# EAGLE design 4U-4452 (EAGLE 6.6.0)
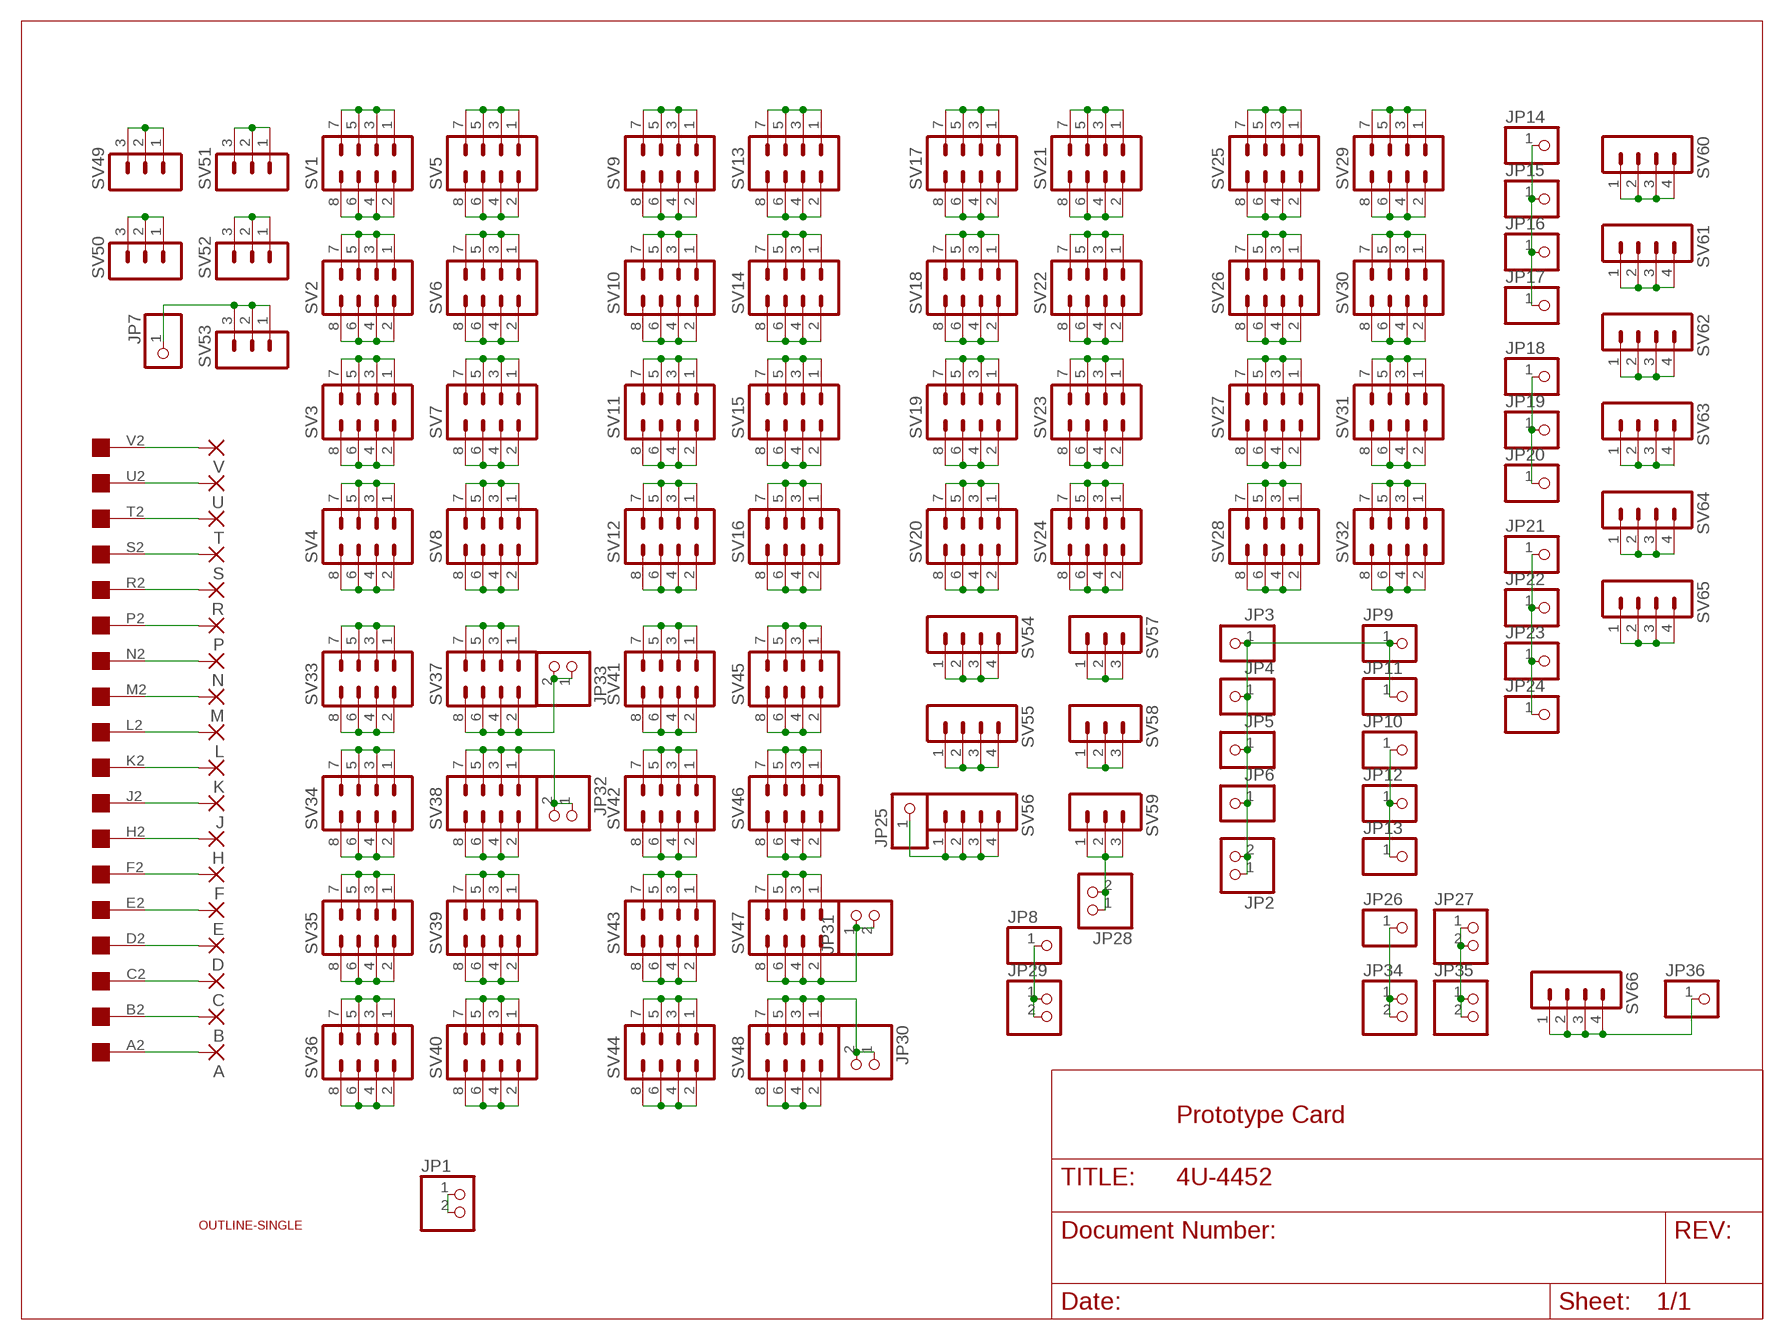
[diagram p0: schematic, sheet 1]

## Parts
A  3,17/1,1  [3,17/1,1]
B  3,17/1,1  [3,17/1,1]
C  3,17/1,1  [3,17/1,1]
D  3,17/1,1  [3,17/1,1]
E  3,17/1,1  [3,17/1,1]
F  3,17/1,1  [3,17/1,1]
H  3,17/1,1  [3,17/1,1]
J  3,17/1,1  [3,17/1,1]
JP1  PINHD-1X2  [1X02]
JP2  PINHD-1X2  [1X02]
JP3  PINHD-1X1  [1X01]
JP4  PINHD-1X1  [1X01]
JP5  PINHD-1X1  [1X01]
JP6  PINHD-1X1  [1X01]
JP7  PINHD-1X1  [1X01]
JP8  PINHD-1X1  [1X01]
JP9  PINHD-1X1  [1X01]
JP10  PINHD-1X1  [1X01]
JP11  PINHD-1X1  [1X01]
JP12  PINHD-1X1  [1X01]
JP13  PINHD-1X1  [1X01]
JP14  PINHD-1X1  [1X01]
JP15  PINHD-1X1  [1X01]
JP16  PINHD-1X1  [1X01]
JP17  PINHD-1X1  [1X01]
JP18  PINHD-1X1  [1X01]
JP19  PINHD-1X1  [1X01]
JP20  PINHD-1X1  [1X01]
JP21  PINHD-1X1  [1X01]
JP22  PINHD-1X1  [1X01]
JP23  PINHD-1X1  [1X01]
JP24  PINHD-1X1  [1X01]
JP25  PINHD-1X1  [1X01]
JP26  PINHD-1X1  [1X01]
JP27  PINHD-1X2  [1X02]
JP28  PINHD-1X2  [1X02]
JP29  PINHD-1X2  [1X02]
JP30  PINHD-1X2  [1X02]
JP31  PINHD-1X2  [1X02]
JP32  PINHD-1X2  [1X02]
JP33  PINHD-1X2  [1X02]
JP34  PINHD-1X2  [1X02]
JP35  PINHD-1X2  [1X02]
JP36  PINHD-1X1  [1X01]
K  3,17/1,1  [3,17/1,1]
L  3,17/1,1  [3,17/1,1]
M  3,17/1,1  [3,17/1,1]
N  3,17/1,1  [3,17/1,1]
P  3,17/1,1  [3,17/1,1]
R  3,17/1,1  [3,17/1,1]
S  3,17/1,1  [3,17/1,1]
SV1  MA04-2  [MA04-2]
SV2  MA04-2  [MA04-2]
SV3  MA04-2  [MA04-2]
SV4  MA04-2  [MA04-2]
SV5  MA04-2  [MA04-2]
SV6  MA04-2  [MA04-2]
SV7  MA04-2  [MA04-2]
SV8  MA04-2  [MA04-2]
SV9  MA04-2  [MA04-2]
SV10  MA04-2  [MA04-2]
SV11  MA04-2  [MA04-2]
SV12  MA04-2  [MA04-2]
SV13  MA04-2  [MA04-2]
SV14  MA04-2  [MA04-2]
SV15  MA04-2  [MA04-2]
SV16  MA04-2  [MA04-2]
SV17  MA04-2  [MA04-2]
SV18  MA04-2  [MA04-2]
SV19  MA04-2  [MA04-2]
SV20  MA04-2  [MA04-2]
SV21  MA04-2  [MA04-2]
SV22  MA04-2  [MA04-2]
SV23  MA04-2  [MA04-2]
SV24  MA04-2  [MA04-2]
SV25  MA04-2  [MA04-2]
SV26  MA04-2  [MA04-2]
SV27  MA04-2  [MA04-2]
SV28  MA04-2  [MA04-2]
SV29  MA04-2  [MA04-2]
SV30  MA04-2  [MA04-2]
SV31  MA04-2  [MA04-2]
SV32  MA04-2  [MA04-2]
SV33  MA04-2  [MA04-2]
SV34  MA04-2  [MA04-2]
SV35  MA04-2  [MA04-2]
SV36  MA04-2  [MA04-2]
SV37  MA04-2  [MA04-2]
SV38  MA04-2  [MA04-2]
SV39  MA04-2  [MA04-2]
SV40  MA04-2  [MA04-2]
SV41  MA04-2  [MA04-2]
SV42  MA04-2  [MA04-2]
SV43  MA04-2  [MA04-2]
SV44  MA04-2  [MA04-2]
SV45  MA04-2  [MA04-2]
SV46  MA04-2  [MA04-2]
SV47  MA04-2  [MA04-2]
SV48  MA04-2  [MA04-2]
SV49  MA03-1  [MA03-1]
SV50  MA03-1  [MA03-1]
SV51  MA03-1  [MA03-1]
SV52  MA03-1  [MA03-1]
SV53  MA03-1  [MA03-1]
SV54  MA04-1  [MA04-1]
SV55  MA04-1  [MA04-1]
SV56  MA04-1  [MA04-1]
SV57  MA03-1  [MA03-1]
SV58  MA03-1  [MA03-1]
SV59  MA03-1  [MA03-1]
SV60  MA04-1  [MA04-1]
SV61  MA04-1  [MA04-1]
SV62  MA04-1  [MA04-1]
SV63  MA04-1  [MA04-1]
SV64  MA04-1  [MA04-1]
SV65  MA04-1  [MA04-1]
SV66  MA04-1  [MA04-1]
T  3,17/1,1  [3,17/1,1]
U  3,17/1,1  [3,17/1,1]
U$1  EDGE-1  [EDGE-CON1]
U$2  OUTLINE-SINGLE  [SINGLE]
V  3,17/1,1  [3,17/1,1]

## Nets
A: A.1(P) U$1.A2
B: B.1(P) U$1.B2
D: D.1(P) U$1.D2
GND: C.1(P) U$1.C2
N$1: U$1.V2 V.1(P)
N$2: U$1.U2 U.1(P)
N$3: T.1(P) U$1.T2
N$4: S.1(P) U$1.S2
N$5: R.1(P) U$1.R2
N$6: P.1(P) U$1.P2
N$7: N.1(P) U$1.N2
N$8: M.1(P) U$1.M2
N$9: L.1(P) U$1.L2
N$10: K.1(P) U$1.K2
N$11: J.1(P) U$1.J2
N$12: H.1(P) U$1.H2
N$13: F.1(P) U$1.F2
N$14: E.1(P) U$1.E2
N$15: SV1.1 SV1.3 SV1.5 SV1.7
N$16: SV1.2 SV1.4 SV1.6 SV1.8
N$17: SV2.1 SV2.3 SV2.5 SV2.7
N$18: SV2.2 SV2.4 SV2.6 SV2.8
N$19: SV3.1 SV3.3 SV3.5 SV3.7
N$20: SV3.2 SV3.4 SV3.6 SV3.8
N$21: SV4.1 SV4.3 SV4.5 SV4.7
N$22: SV4.2 SV4.4 SV4.6 SV4.8
N$23: SV5.1 SV5.3 SV5.5 SV5.7
N$24: SV5.2 SV5.4 SV5.6 SV5.8
N$25: SV6.1 SV6.3 SV6.5 SV6.7
N$26: SV6.2 SV6.4 SV6.6 SV6.8
N$27: SV7.1 SV7.3 SV7.5 SV7.7
N$28: SV7.2 SV7.4 SV7.6 SV7.8
N$29: SV8.1 SV8.3 SV8.5 SV8.7
N$30: SV8.2 SV8.4 SV8.6 SV8.8
N$31: SV9.1 SV9.3 SV9.5 SV9.7
N$32: SV9.2 SV9.4 SV9.6 SV9.8
N$33: SV10.1 SV10.3 SV10.5 SV10.7
N$34: SV10.2 SV10.4 SV10.6 SV10.8
N$35: SV11.1 SV11.3 SV11.5 SV11.7
N$36: SV11.2 SV11.4 SV11.6 SV11.8
N$37: SV12.1 SV12.3 SV12.5 SV12.7
N$38: SV12.2 SV12.4 SV12.6 SV12.8
N$39: SV13.1 SV13.3 SV13.5 SV13.7
N$40: SV13.2 SV13.4 SV13.6 SV13.8
N$41: SV14.1 SV14.3 SV14.5 SV14.7
N$42: SV14.2 SV14.4 SV14.6 SV14.8
N$43: SV15.1 SV15.3 SV15.5 SV15.7
N$44: SV15.2 SV15.4 SV15.6 SV15.8
N$45: SV16.1 SV16.3 SV16.5 SV16.7
N$46: SV16.2 SV16.4 SV16.6 SV16.8
N$47: SV17.1 SV17.3 SV17.5 SV17.7
N$48: SV17.2 SV17.4 SV17.6 SV17.8
N$49: SV18.1 SV18.3 SV18.5 SV18.7
N$50: SV18.2 SV18.4 SV18.6 SV18.8
N$51: SV19.1 SV19.3 SV19.5 SV19.7
N$52: SV19.2 SV19.4 SV19.6 SV19.8
N$53: SV20.1 SV20.3 SV20.5 SV20.7
N$54: SV20.2 SV20.4 SV20.6 SV20.8
N$55: SV21.1 SV21.3 SV21.5 SV21.7
N$56: SV21.2 SV21.4 SV21.6 SV21.8
N$57: SV22.1 SV22.3 SV22.5 SV22.7
N$58: SV22.2 SV22.4 SV22.6 SV22.8
N$59: SV23.1 SV23.3 SV23.5 SV23.7
N$60: SV23.2 SV23.4 SV23.6 SV23.8
N$61: SV24.1 SV24.3 SV24.5 SV24.7
N$62: SV24.2 SV24.4 SV24.6 SV24.8
N$63: SV25.1 SV25.3 SV25.5 SV25.7
N$64: SV25.2 SV25.4 SV25.6 SV25.8
N$65: SV26.1 SV26.3 SV26.5 SV26.7
N$66: SV26.2 SV26.4 SV26.6 SV26.8
N$67: SV27.1 SV27.3 SV27.5 SV27.7
N$68: SV27.2 SV27.4 SV27.6 SV27.8
N$69: SV28.1 SV28.3 SV28.5 SV28.7
N$70: SV28.2 SV28.4 SV28.6 SV28.8
N$71: SV29.1 SV29.3 SV29.5 SV29.7
N$72: SV29.2 SV29.4 SV29.6 SV29.8
N$73: SV30.1 SV30.3 SV30.5 SV30.7
N$74: SV30.2 SV30.4 SV30.6 SV30.8
N$75: SV31.1 SV31.3 SV31.5 SV31.7
N$76: SV31.2 SV31.4 SV31.6 SV31.8
N$77: SV32.1 SV32.3 SV32.5 SV32.7
N$78: SV32.2 SV32.4 SV32.6 SV32.8
N$79: SV33.1 SV33.3 SV33.5 SV33.7
N$80: SV33.2 SV33.4 SV33.6 SV33.8
N$81: SV34.1 SV34.3 SV34.5 SV34.7
N$82: SV34.2 SV34.4 SV34.6 SV34.8
N$83: SV35.1 SV35.3 SV35.5 SV35.7
N$84: SV35.2 SV35.4 SV35.6 SV35.8
N$85: SV36.1 SV36.3 SV36.5 SV36.7
N$86: SV36.2 SV36.4 SV36.6 SV36.8
N$87: SV37.1 SV37.3 SV37.5 SV37.7
N$88: JP33.1 JP33.2 SV37.2 SV37.4 SV37.6 SV37.8
N$89: JP32.1 JP32.2 SV38.1 SV38.3 SV38.5 SV38.7
N$90: SV38.2 SV38.4 SV38.6 SV38.8
N$91: SV39.1 SV39.3 SV39.5 SV39.7
N$92: SV39.2 SV39.4 SV39.6 SV39.8
N$93: SV40.1 SV40.3 SV40.5 SV40.7
N$94: SV40.2 SV40.4 SV40.6 SV40.8
N$95: SV41.1 SV41.3 SV41.5 SV41.7
N$96: SV41.2 SV41.4 SV41.6 SV41.8
N$97: SV42.1 SV42.3 SV42.5 SV42.7
N$98: SV42.2 SV42.4 SV42.6 SV42.8
N$99: SV43.1 SV43.3 SV43.5 SV43.7
N$100: SV43.2 SV43.4 SV43.6 SV43.8
N$101: SV44.1 SV44.3 SV44.5 SV44.7
N$102: SV44.2 SV44.4 SV44.6 SV44.8
N$103: SV45.1 SV45.3 SV45.5 SV45.7
N$104: SV45.2 SV45.4 SV45.6 SV45.8
N$105: SV46.1 SV46.3 SV46.5 SV46.7
N$106: SV46.2 SV46.4 SV46.6 SV46.8
N$107: SV47.1 SV47.3 SV47.5 SV47.7
N$108: JP31.1 JP31.2 SV47.2 SV47.4 SV47.6 SV47.8
N$109: JP30.1 JP30.2 SV48.1 SV48.3 SV48.5 SV48.7
N$110: JP10.1 JP12.1 JP13.1
N$111: SV51.1 SV51.2 SV51.3
N$112: SV50.1 SV50.2 SV50.3
N$113: SV49.1 SV49.2 SV49.3
N$114: SV52.1 SV52.2 SV52.3
N$115: JP7.1 SV53.1 SV53.2 SV53.3
N$116: JP1.1 JP1.2
N$117: JP2.1 JP2.2 JP3.1 JP4.1 JP5.1 JP6.1 JP9.1 JP11.1
N$118: SV54.1 SV54.2 SV54.3 SV54.4
N$119: SV55.1 SV55.2 SV55.3 SV55.4
N$120: JP25.1 SV56.1 SV56.2 SV56.3 SV56.4
N$121: SV58.1 SV58.2 SV58.3
N$122: SV57.1 SV57.2 SV57.3
N$123: JP28.1 JP28.2 SV59.1 SV59.2 SV59.3
N$124: JP21.1 JP22.1 JP23.1 JP24.1
N$125: JP18.1 JP19.1 JP20.1
N$126: JP14.1 JP15.1 JP16.1 JP17.1
N$127: SV60.1 SV60.2 SV60.3 SV60.4
N$128: SV61.1 SV61.2 SV61.3 SV61.4
N$129: SV62.1 SV62.2 SV62.3 SV62.4
N$130: SV63.1 SV63.2 SV63.3 SV63.4
N$131: SV64.1 SV64.2 SV64.3 SV64.4
N$132: SV65.1 SV65.2 SV65.3 SV65.4
N$133: JP27.1 JP27.2 JP35.1 JP35.2
N$134: SV48.2 SV48.4 SV48.6 SV48.8
N$135: JP8.1 JP29.1 JP29.2
N$141: JP26.1 JP34.1 JP34.2
N$142: JP36.1 SV66.1 SV66.2 SV66.3 SV66.4

## Notes on the sheet
- Prototype Card

## Library data of the parts
A B C D E F H J K L M N P R S T U V = wirepad:3,17/1,1: THROUGH-HOLE PAD
JP1 JP2 JP27-JP35 = pinhead:PINHD-1X2: PIN HEADER
JP3-JP26 JP36 = pinhead:PINHD-1X1: PIN HEADER
SV1-SV48 = con-lstb:MA04-2: PIN HEADER; OC_FARNELL: unknown; OC_NEWARK: unknown
SV49-SV53 SV57-SV59 = con-lstb:MA03-1: PIN HEADER; OC_FARNELL: unknown; OC_NEWARK: unknown
SV54-SV56 SV60-SV66 = con-lstb:MA04-1: PIN HEADER; OC_FARNELL: unknown; OC_NEWARK: unknown
U$1 = dec-con:EDGE-1: Single-Sided DEC Edge Connector -- (side 2)
U$2 = dec-con:OUTLINE-*: Board outlines for DEC boards.

## Net classes
0 default: width 1.016 mm

## Board
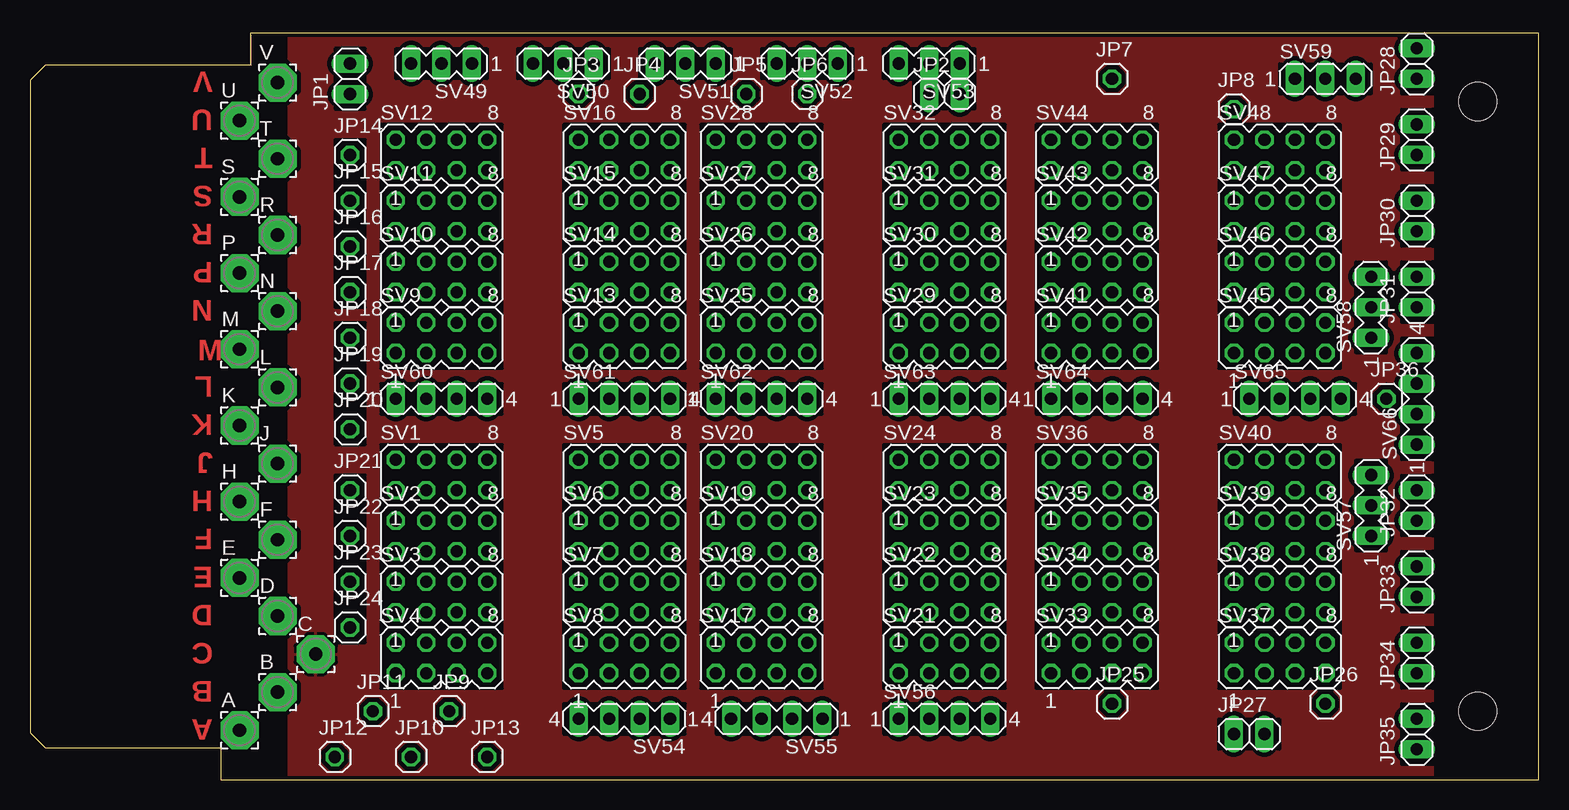
[diagram p1: board, top side]
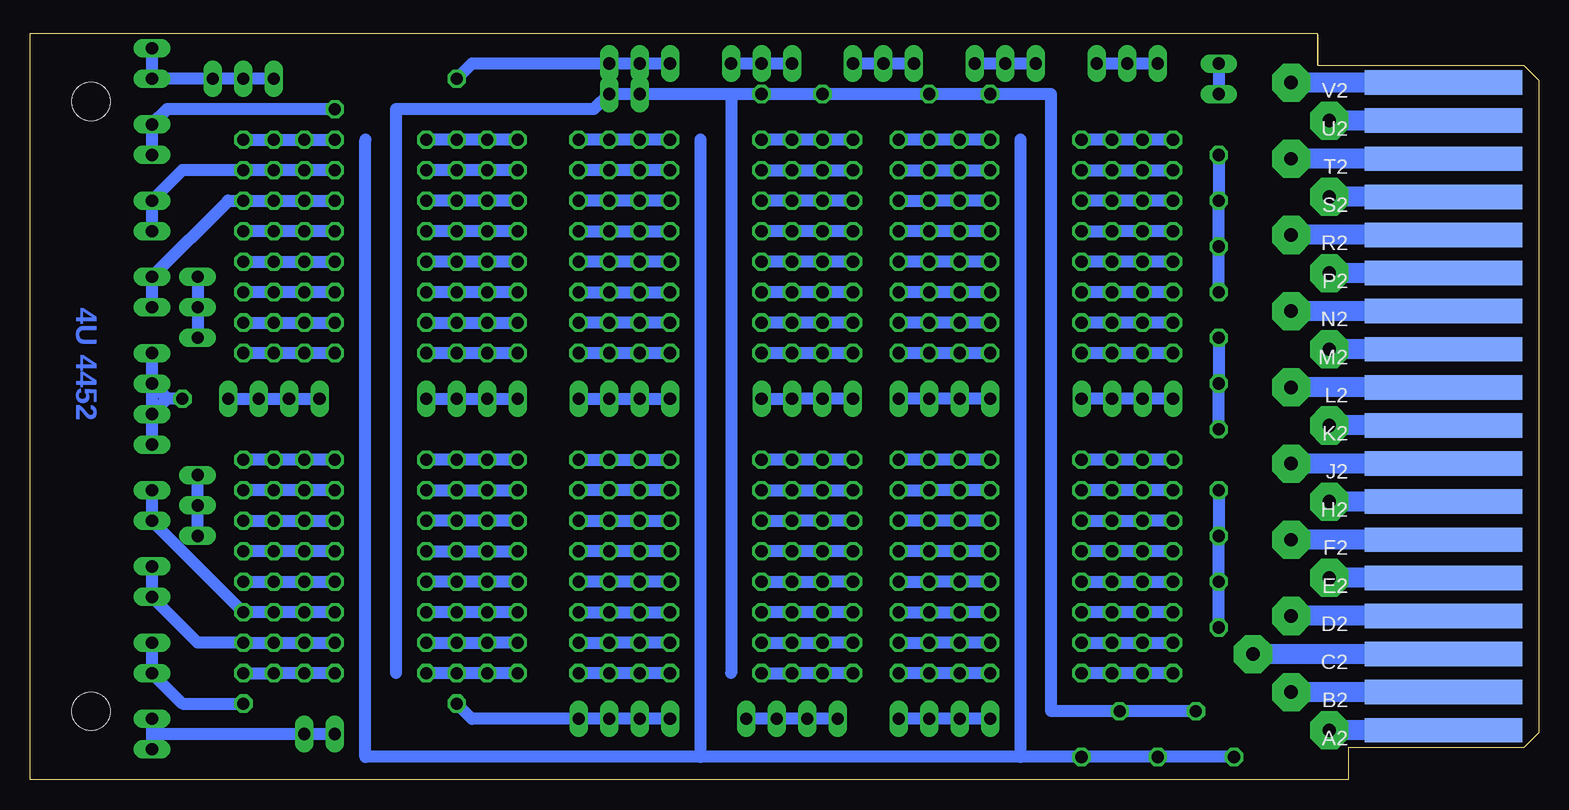
[diagram p2: board, bottom side, seen from below]

Size 125.73 x 62.23 mm. Coordinates in mm from the lower left corner, seen from the top.
Copper layers (1+16): Top 0.035mm / dielectric 1.5mm / Bottom 0.035mm
Design rules "16mils *": minimum track width 16mil, minimum drill 32mil, track to track 15mil, track to pad 10mil, pad to pad 10mil, via to via 10mil, smd to smd 10mil, copper to edge 13mil, drill to drill 10mil, minimum pad ring 10mil, minimum via ring 8mil, stop-mask expansion 0mil, vias tented up to drill 0mil, thermal gap 10mil
tRestrict: area 29.2,34.3 to 39.4,54.6; area 44.5,34.3 to 54.6,54.6; area 55.9,34.3 to 66,54.6; area 71.1,34.3 to 81.3,54.6; area 83.8,34.3 to 94,54.6; area 99.1,34.3 to 109.2,54.6; area 99.1,7.6 to 109.2,27.9; area 83.8,7.6 to 94,27.9; area 71.1,7.6 to 81.3,27.9; area 44.5,7.6 to 54.6,27.9; area 55.9,7.6 to 66,27.9; area 29.2,7.6 to 39.4,27.9; area 25.4,55.9 to 27.9,61; area 30.5,58.4 to 38.1,61; area 40.6,58.4 to 48.3,61; area 50.8,58.4 to 58.4,61; area 61,58.4 to 68.6,61; area 71.1,58.4 to 78.7,61; area 73.7,55.9 to 78.7,58.4; area 44.5,3.8 to 54.6,6.3; area 57.2,3.8 to 67.3,6.3; area 71.1,3.8 to 81.3,6.3; area 110.5,35.6 to 113,43.2; area 110.5,19.1 to 113,26.7; area 104.1,57.1 to 111.8,59.7; area 25.4,39.4 to 27.9,53.3; area 25.4,11.4 to 27.9,25.4; area 25.4,27.9 to 27.9,38.1; area 44.5,30.5 to 54.6,33; area 29.2,30.5 to 39.4,33; area 55.9,30.5 to 66,33; area 71.1,30.5 to 81.3,33; area 83.8,30.5 to 94,33; area 100.3,30.5 to 110.5,33; area 99.1,2.5 to 104.1,5.1; area 114.3,1.3 to 116.8,6.3; area 114.3,7.6 to 116.8,12.7; area 114.3,14 to 116.8,19.1; area 114.3,20.3 to 116.8,25.4; area 114.3,38.1 to 116.8,43.2; area 114.3,44.5 to 116.8,49.5; area 114.3,50.8 to 116.8,55.9; area 114.3,57.1 to 116.8,62.2; area 111.8,26.7 to 116.8,36.8

### Footprints (pad centres in the part's own frame; a part is rotated, then mirrored left to right if it is on the bottom)
3,17/1,1 = drill 1.118 pad 3.175 octagon: 1 0,0
1X02 = drill 1.016 long: 1 -1.27,0; 2 1.27,0
1X01 = drill 1.016 octagon: 1 0,0
MA04-2 = drill 1.016 octagon: 1 -3.81,-1.27; 2 -3.81,1.27; 3 -1.27,-1.27; 4 -1.27,1.27; 5 1.27,-1.27; 6 1.27,1.27; 7 3.81,-1.27; 8 3.81,1.27
MA03-1 = drill 1.016 long: 1 -2.54,0; 2 0,0; 3 2.54,0
MA04-1 = drill 1.016 long: 1 -3.81,0; 2 -1.27,0; 3 1.27,0; 4 3.81,0
EDGE-CON1 = smd 13.106 x 2.032 bottom: A2 7.938,4.128; B2 7.938,7.303; C2 7.938,10.477; D2 7.938,13.652; E2 7.938,16.828; F2 7.938,20.003; H2 7.938,23.177; J2 7.938,26.352; K2 7.938,29.527; L2 7.938,32.703; M2 7.938,35.877; N2 7.938,39.053; P2 7.938,42.227; R2 7.938,45.403; S2 7.938,48.578; T2 7.938,51.752; U2 7.938,54.928; V2 7.938,58.102
SINGLE = hole 3.175: 120.65,56.515; 120.65,5.715

### Placement (x,y rotation side)
A  17.46,4.13 0 top
B  20.64,7.3 0 top
C  23.81,10.48 0 top
D  20.64,13.65 0 top
E  17.46,16.83 0 top
F  20.64,20 0 top
H  17.46,23.18 0 top
J  20.64,26.35 0 top
JP1  26.67,58.42 90 top
JP2  76.2,57.15 0 top
JP3  45.72,57.15 0 top
JP4  50.8,57.15 0 top
JP5  59.69,57.15 0 top
JP6  64.77,57.15 0 top
JP7  90.17,58.42 0 top
JP8  100.33,55.88 0 top
JP9  34.93,5.71 0 top
JP10  31.75,1.91 0 top
JP11  28.58,5.71 0 top
JP12  25.4,1.91 0 top
JP13  38.1,1.91 0 top
JP14  26.67,52.07 0 top
JP15  26.67,48.26 0 top
JP16  26.67,44.45 0 top
JP17  26.67,40.64 0 top
JP18  26.67,36.83 0 top
JP19  26.67,33.02 0 top
JP20  26.67,29.21 0 top
JP21  26.67,24.13 0 top
JP22  26.67,20.32 0 top
JP23  26.67,16.51 0 top
JP24  26.67,12.7 0 top
JP25  90.17,6.35 0 top
JP26  107.95,6.35 0 top
JP27  101.6,3.81 0 top
JP28  115.57,59.69 90 top
JP29  115.57,53.34 90 top
JP30  115.57,46.99 90 top
JP31  115.57,40.64 90 top
JP32  115.57,22.86 90 top
JP33  115.57,16.51 90 top
JP34  115.57,10.16 90 top
JP35  115.57,3.81 90 top
JP36  113.03,31.75 0 top
K  17.46,29.53 0 top
L  20.64,32.7 0 top
M  17.46,35.88 0 top
N  20.64,39.05 0 top
P  17.46,42.23 0 top
R  20.64,45.4 0 top
S  17.46,48.58 0 top
SV1  34.29,25.4 0 top
SV2  34.29,20.32 0 top
SV3  34.29,15.24 0 top
SV4  34.29,10.16 0 top
SV5  49.53,25.4 0 top
SV6  49.53,20.32 0 top
SV7  49.53,15.24 0 top
SV8  49.53,10.16 0 top
SV9  34.29,36.83 0 top
SV10  34.29,41.91 0 top
SV11  34.29,46.99 0 top
SV12  34.29,52.07 0 top
SV13  49.53,36.83 0 top
SV14  49.53,41.91 0 top
SV15  49.53,46.99 0 top
SV16  49.53,52.07 0 top
SV17  60.96,10.16 0 top
SV18  60.96,15.24 0 top
SV19  60.96,20.32 0 top
SV20  60.96,25.4 0 top
SV21  76.2,10.16 0 top
SV22  76.2,15.24 0 top
SV23  76.2,20.32 0 top
SV24  76.2,25.4 0 top
SV25  60.96,36.83 0 top
SV26  60.96,41.91 0 top
SV27  60.96,46.99 0 top
SV28  60.96,52.07 0 top
SV29  76.2,36.83 0 top
SV30  76.2,41.91 0 top
SV31  76.2,46.99 0 top
SV32  76.2,52.07 0 top
SV33  88.9,10.16 0 top
SV34  88.9,15.24 0 top
SV35  88.9,20.32 0 top
SV36  88.9,25.4 0 top
SV37  104.14,10.16 0 top
SV38  104.14,15.24 0 top
SV39  104.14,20.32 0 top
SV40  104.14,25.4 0 top
SV41  88.9,36.83 0 top
SV42  88.9,41.91 0 top
SV43  88.9,46.99 0 top
SV44  88.9,52.07 0 top
SV45  104.14,36.83 0 top
SV46  104.14,41.91 0 top
SV47  104.14,46.99 0 top
SV48  104.14,52.07 0 top
SV49  34.29,59.69 180 top
SV50  44.45,59.69 180 top
SV51  54.61,59.69 180 top
SV52  64.77,59.69 180 top
SV53  74.93,59.69 180 top
SV54  49.53,5.08 180 top
SV55  62.23,5.08 180 top
SV56  76.2,5.08 0 top
SV57  111.76,22.86 90 top
SV58  111.76,39.37 90 top
SV59  107.95,58.42 0 top
SV60  34.29,31.75 0 top
SV61  49.53,31.75 0 top
SV62  60.96,31.75 0 top
SV63  76.2,31.75 0 top
SV64  88.9,31.75 0 top
SV65  105.41,31.75 0 top
SV66  115.57,31.75 90 top
T  20.64,51.75 0 top
U  17.46,54.93 0 top
U$1  0,0 0 top
U$2  0,0 0 top
V  20.64,58.1 0 top

### Tracks (layer width: path | path; a pad name or v marks a point on that pad's centre or on a via)
A
  Bottom 1.676: U$1.A2 A.1
B
  Bottom 1.676: U$1.B2 B.1
D
  Bottom 1.676: U$1.D2 D.1
GND
  Bottom 1.676: U$1.C2 C.1
  pour Top: 21.59,0 21.59,62.23 116.84,62.23 116.84,0
N$1
  Bottom 1.676: U$1.V2 V.1
N$2
  Bottom 1.676: U$1.U2 U.1
N$3
  Bottom 1.676: U$1.T2 T.1
N$4
  Bottom 1.676: U$1.S2 S.1
N$5
  Bottom 1.676: U$1.R2 R.1
N$6
  Bottom 1.676: U$1.P2 P.1
N$7
  Bottom 1.676: U$1.N2 N.1
N$8
  Bottom 1.676: U$1.M2 M.1
N$9
  Bottom 1.676: U$1.L2 L.1
N$10
  Bottom 1.676: U$1.K2 K.1
N$11
  Bottom 1.676: U$1.J2 J.1
N$12
  Bottom 1.676: U$1.H2 H.1
N$13
  Bottom 1.676: U$1.F2 F.1
N$14
  Bottom 1.676: U$1.E2 E.1
N$15
  Bottom 1.016: SV1.1 SV1.3 SV1.5 SV1.7
N$16
  Bottom 1.016: SV1.2 SV1.4 SV1.6 SV1.8
N$17
  Bottom 1.016: SV2.1 SV2.3 SV2.5 SV2.7
N$18
  Bottom 1.016: SV2.8 SV2.6 SV2.4 SV2.2
N$19
  Bottom 1.016: SV3.1 SV3.3 SV3.5 SV3.7
N$20
  Bottom 1.016: SV3.8 SV3.6 SV3.4 SV3.2
N$21
  Bottom 1.016: SV4.1 SV4.3 SV4.5 SV4.7
N$22
  Bottom 1.016: SV4.8 SV4.6 SV4.4 SV4.2
N$23
  Bottom 1.016: SV5.7 SV5.5 SV5.3 SV5.1
N$24
  Bottom 1.016: SV5.2 SV5.4 SV5.6 SV5.8
N$25
  Bottom 1.016: SV6.1 SV6.3 SV6.5 SV6.7
N$26
  Bottom 1.016: SV6.2 SV6.4 SV6.6 SV6.8
N$27
  Bottom 1.016: SV7.1 SV7.3 SV7.5 SV7.7
N$28
  Bottom 1.016: SV7.2 SV7.4 SV7.6 SV7.8
N$29
  Bottom 1.016: SV8.1 SV8.3 SV8.5 SV8.7
N$30
  Bottom 1.016: SV8.2 SV8.4 SV8.6 SV8.8
N$31
  Bottom 1.016: SV9.1 SV9.3 SV9.5 SV9.7
N$32
  Bottom 1.016: SV9.2 SV9.4 SV9.6 SV9.8
N$33
  Bottom 1.016: SV10.1 SV10.3 SV10.5 SV10.7
N$34
  Bottom 1.016: SV10.2 SV10.4 SV10.6 SV10.8
N$35
  Bottom 1.016: SV11.7 SV11.5 SV11.3 SV11.1
N$36
  Bottom 1.016: SV11.2 SV11.4 SV11.6 SV11.8
N$37
  Bottom 1.016: SV12.7 SV12.5 SV12.3 SV12.1
N$38
  Bottom 1.016: SV12.2 SV12.4 SV12.6 SV12.8
N$39
  Bottom 1.016: SV13.1 SV13.3 SV13.5 SV13.7
N$40
  Bottom 1.016: SV13.2 SV13.4 SV13.6 SV13.8
N$41
  Bottom 1.016: SV14.1 SV14.3 SV14.5 SV14.7
N$42
  Bottom 1.016: SV14.2 SV14.4 SV14.6 SV14.8
N$43
  Bottom 1.016: SV15.1 SV15.3 SV15.5 SV15.7
N$44
  Bottom 1.016: SV15.2 SV15.4 SV15.6 SV15.8
N$45
  Bottom 1.016: SV16.7 SV16.5 SV16.3 SV16.1
N$46
  Bottom 1.016: SV16.2 SV16.4 SV16.6 SV16.8
N$47
  Bottom 1.016: SV17.1 SV17.3 SV17.5 SV17.7
N$48
  Bottom 1.016: SV17.8 SV17.6 SV17.4 SV17.2
N$49
  Bottom 1.016: SV18.1 SV18.3 SV18.5 SV18.7
N$50
  Bottom 1.016: SV18.8 SV18.6 SV18.4 SV18.2
N$51
  Bottom 1.016: SV19.1 SV19.3 SV19.5 SV19.7
N$52
  Bottom 1.016: SV19.8 SV19.6 SV19.4 SV19.2
N$53
  Bottom 1.016: SV20.7 SV20.5 SV20.3 SV20.1
N$54
  Bottom 1.016: SV20.2 SV20.4 SV20.6 SV20.8
N$55
  Bottom 1.016: SV21.1 SV21.3 SV21.5 SV21.7
N$56
  Bottom 1.016: SV21.2 SV21.4 SV21.6 SV21.8
N$57
  Bottom 1.016: SV22.7 SV22.5 SV22.3 SV22.1
N$58
  Bottom 1.016: SV22.2 SV22.4 SV22.6 SV22.8
N$59
  Bottom 1.016: SV23.1 SV23.3 SV23.5 SV23.7
N$60
  Bottom 1.016: SV23.8 SV23.6 SV23.4 SV23.2
N$61
  Bottom 1.016: SV24.1 SV24.3 SV24.5 SV24.7
N$62
  Bottom 1.016: SV24.8 SV24.6 SV24.4 SV24.2
N$63
  Bottom 1.016: SV25.1 SV25.3 SV25.5 SV25.7
N$64
  Bottom 1.016: SV25.2 SV25.4 SV25.6 SV25.8
N$65
  Bottom 1.016: SV26.1 SV26.3 SV26.5 SV26.7
N$66
  Bottom 1.016: SV26.2 SV26.4 SV26.6 SV26.8
N$67
  Bottom 1.016: SV27.1 SV27.3 SV27.5 SV27.7
N$68
  Bottom 1.016: SV27.2 SV27.4 SV27.6 SV27.8
N$69
  Bottom 1.016: SV28.7 SV28.5 SV28.3 SV28.1
N$70
  Bottom 1.016: SV28.2 SV28.4 SV28.6 SV28.8
N$71
  Bottom 1.016: SV29.1 SV29.3 SV29.5 SV29.7
N$72
  Bottom 1.016: SV29.2 SV29.4 SV29.6 SV29.8
N$73
  Bottom 1.016: SV30.7 SV30.5 SV30.3 SV30.1
N$74
  Bottom 1.016: SV30.2 SV30.4 SV30.6 SV30.8
N$75
  Bottom 1.016: SV31.7 SV31.5 SV31.3 SV31.1
N$76
  Bottom 1.016: SV31.2 SV31.4 SV31.6 SV31.8
N$77
  Bottom 1.016: SV32.1 SV32.3 SV32.5 SV32.7
N$78
  Bottom 1.016: SV32.2 SV32.4 SV32.6 SV32.8
N$79
  Bottom 1.016: SV33.1 SV33.3 SV33.5 SV33.7
N$80
  Bottom 1.016: SV33.8 SV33.6 SV33.4 SV33.2
N$81
  Bottom 1.016: SV34.1 SV34.3 SV34.5 SV34.7
N$82
  Bottom 1.016: SV34.2 SV34.4 SV34.6 SV34.8
N$83
  Bottom 1.016: SV35.7 SV35.5 SV35.3 SV35.1
N$84
  Bottom 1.016: SV35.2 SV35.4 SV35.6 SV35.8
N$85
  Bottom 1.016: SV36.7 SV36.5 SV36.3 SV36.1
N$86
  Bottom 1.016: SV36.2 SV36.4 SV36.6 SV36.8
N$87
  Bottom 1.016: SV37.1 SV37.3 SV37.5 SV37.7
N$88
  Bottom 1.016: SV37.2 SV37.4 SV37.6 SV37.8 111.76,11.43 JP33.1 JP33.2
N$89
  Bottom 1.016: SV38.1 SV38.3 SV38.5 SV38.7 JP32.1 JP32.2
N$90
  Bottom 1.016: SV38.8 SV38.6 SV38.4 SV38.2
N$91
  Bottom 1.016: SV39.1 SV39.3 SV39.5 SV39.7
N$92
  Bottom 1.016: SV39.8 SV39.6 SV39.4 SV39.2
N$93
  Bottom 1.016: SV40.1 SV40.3 SV40.5 SV40.7
N$94
  Bottom 1.016: SV40.2 SV40.4 SV40.6 SV40.8
N$95
  Bottom 1.016: SV41.1 SV41.3 SV41.5 SV41.7
N$96
  Bottom 1.016: SV41.8 SV41.6 SV41.4 SV41.2
N$97
  Bottom 1.016: SV42.1 SV42.3 SV42.5 SV42.7
N$98
  Bottom 1.016: SV42.2 SV42.4 SV42.6 SV42.8
N$99
  Bottom 1.016: SV43.1 SV43.3 SV43.5 SV43.7
N$100
  Bottom 1.016: SV43.2 SV43.4 SV43.6 SV43.8
N$101
  Bottom 1.016: SV44.1 SV44.3 SV44.5 SV44.7
N$102
  Bottom 1.016: SV44.2 SV44.4 SV44.6 SV44.8
N$103
  Bottom 1.016: SV45.1 SV45.3 SV45.5 SV45.7
N$104
  Bottom 1.016: SV45.8 SV45.6 SV45.4 SV45.2
N$105
  Bottom 1.016: SV46.1 SV46.3 SV46.5 SV46.7
N$106
  Bottom 1.016: SV46.8 SV46.6 SV46.4 SV46.2
N$107
  Bottom 1.016: SV47.1 SV47.3 SV47.5 SV47.7
N$108
  Bottom 1.016: SV47.2 SV47.4 SV47.6 SV47.8 109.22,48.26 JP31.2 JP31.1
N$109
  Bottom 1.016: SV48.1 SV48.3 SV48.5 SV48.7 113.03,50.8 JP30.2 JP30.1
N$110
  Bottom 1.016: JP12.1 JP10.1 JP13.1 43.18,1.91 | 43.18,1.91 69.85,1.91 | 69.85,1.91 97.79,1.91 97.79,53.34 | 43.18,1.91 43.18,53.34 | 69.85,1.91 69.85,53.34
N$111
  Bottom 1.016: SV51.3 SV51.2 SV51.1
N$112
  Bottom 1.016: SV50.3 SV50.2 SV50.1
N$113
  Bottom 1.016: SV49.3 SV49.2 SV49.1
N$114
  Bottom 1.016: SV52.3 SV52.2 SV52.1
N$115
  Bottom 1.016: SV53.3 SV53.2 SV53.1 88.9,59.69 JP7.1
N$116
  Bottom 1.016: JP1.2 JP1.1
N$117
  Bottom 1.016: JP11.1 JP9.1 40.64,5.71 40.64,57.15 JP3.1 JP4.1 JP5.1 JP6.1 67.31,57.15 | 67.31,57.15 67.31,8.89 | 67.31,57.15 JP2.1 JP2.2 78.74,55.88 95.25,55.88 95.25,8.89
N$118
  Bottom 1.016: SV54.4 SV54.3 SV54.2 SV54.1
N$119
  Bottom 1.016: SV55.4 SV55.3 SV55.2 SV55.1
N$120
  Bottom 1.016: SV56.1 SV56.2 SV56.3 SV56.4 88.9,5.08 JP25.1
N$121
  Bottom 1.016: SV58.3 SV58.2 SV58.1
N$122
  Bottom 1.016: SV57.1 SV57.2 SV57.3
N$123
  Bottom 1.016: JP28.2 JP28.1 SV59.3 SV59.2 SV59.1
N$124
  Bottom 1.016: JP24.1 JP23.1 JP22.1 JP21.1
N$125
  Bottom 1.016: JP20.1 JP19.1 JP18.1
N$126
  Bottom 1.016: JP14.1 JP15.1 JP16.1 JP17.1
N$127
  Bottom 1.016: SV60.1 SV60.2 SV60.3 SV60.4
N$128
  Bottom 1.016: SV61.1 SV61.2 SV61.3 SV61.4
N$129
  Bottom 1.016: SV62.4 SV62.3 SV62.2 SV62.1
N$130
  Bottom 1.016: SV63.4 SV63.3 SV63.2 SV63.1
N$131
  Bottom 1.016: SV64.4 SV64.3 SV64.2 SV64.1
N$132
  Bottom 1.016: SV65.4 SV65.3 SV65.2 SV65.1
N$133
  Bottom 1.016: JP35.2 115.57,3.81 | 115.57,3.81 JP35.1 | JP27.1 JP27.2 115.57,3.81
N$134
  Bottom 1.016: SV48.8 SV48.6 SV48.4 SV48.2
N$135
  Bottom 1.016: JP29.1 JP29.2 114.3,55.88 JP8.1
N$141
  Bottom 1.016: JP34.2 JP34.1 113.03,6.35 JP26.1
N$142
  Bottom 1.016: SV66.4 SV66.3 | SV66.3 SV66.2 | SV66.2 SV66.1 | 114.3,31.75 SV66.2 | JP36.1 114.3,31.75 | 114.3,31.75 SV66.3

### Text on the board
Top: V | U | T | S | R | P | N | M | L | K | J | H | F | E | D | C | B | A
Bottom: 4U 4452
tRestrict: M6 | M2 | M4 | 8 | 1 | M1 | M3 | M5